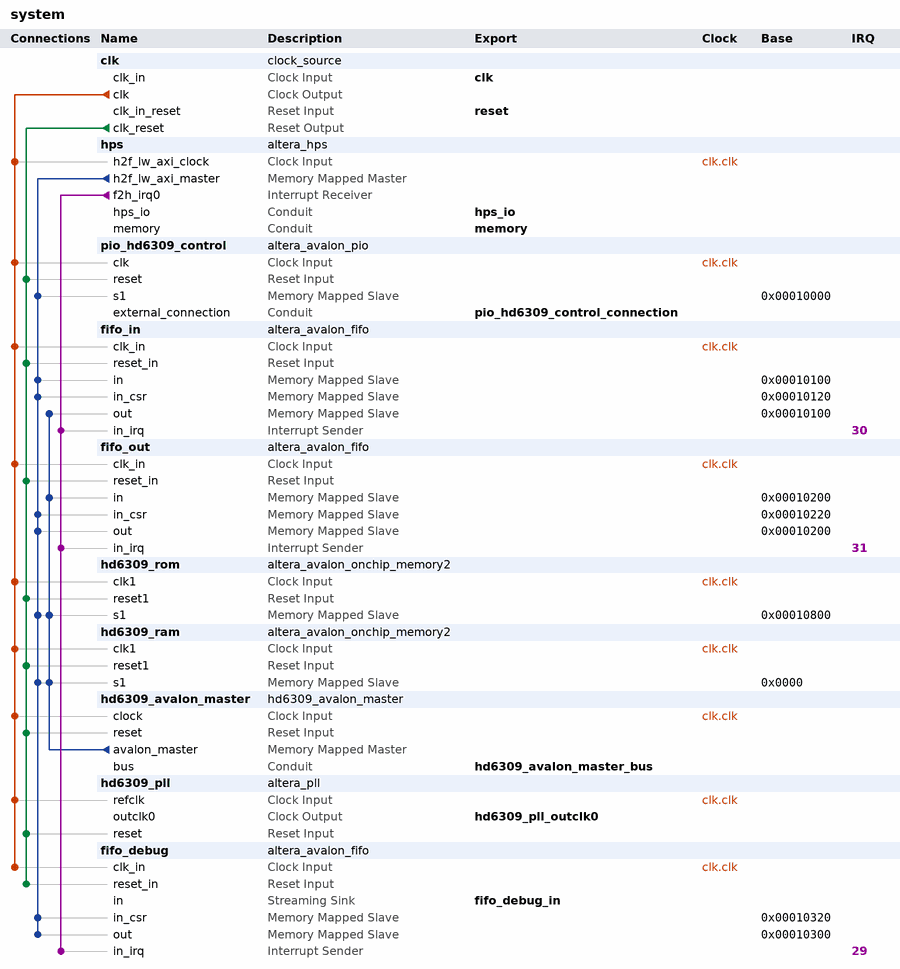
[diagram p0: system contents]
# Platform Designer (Qsys) system system, Cyclone V 5CSEMA4U23C6
# Parameters at their usual value, and those the tool derives, are not listed.
package require -exact qsys 16.1
create_system system
set_project_property DEVICE_FAMILY {Cyclone V}
set_project_property DEVICE 5CSEMA4U23C6

add_instance clk clock_source 16.1
set_instance_parameter_value clk clockFrequency 50000000

add_instance hps altera_hps 16.1
set_instance_parameter_value hps EMAC1_Mode RGMII
set_instance_parameter_value hps EMAC1_PinMuxing {HPS I/O Set 0}
set_instance_parameter_value hps F2SCLK_COLDRST_Enable false
set_instance_parameter_value hps F2SCLK_DBGRST_Enable false
set_instance_parameter_value hps F2SCLK_WARMRST_Enable false
set_instance_parameter_value hps F2SINTERRUPT_Enable true
set_instance_parameter_value hps F2S_Width 0
set_instance_parameter_value hps FPGA_PERIPHERAL_OUTPUT_CLOCK_FREQ_EMAC0_GTX_CLK 100
set_instance_parameter_value hps FPGA_PERIPHERAL_OUTPUT_CLOCK_FREQ_EMAC0_MD_CLK 100.0
set_instance_parameter_value hps FPGA_PERIPHERAL_OUTPUT_CLOCK_FREQ_EMAC1_GTX_CLK 100
set_instance_parameter_value hps FPGA_PERIPHERAL_OUTPUT_CLOCK_FREQ_EMAC1_MD_CLK 100.0
set_instance_parameter_value hps HPS_PROTOCOL DDR3
set_instance_parameter_value hps I2C0_Mode I2C
set_instance_parameter_value hps I2C0_PinMuxing {HPS I/O Set 0}
set_instance_parameter_value hps I2C1_Mode I2C
set_instance_parameter_value hps I2C1_PinMuxing {HPS I/O Set 0}
set_instance_parameter_value hps LWH2F_Enable true
set_instance_parameter_value hps MEM_BANKADDR_WIDTH 3
set_instance_parameter_value hps MEM_CLK_FREQ 400.0
set_instance_parameter_value hps MEM_COL_ADDR_WIDTH 10
set_instance_parameter_value hps MEM_DQ_WIDTH 32
set_instance_parameter_value hps MEM_DRV_STR RZQ/6
set_instance_parameter_value hps MEM_ROW_ADDR_WIDTH 15
set_instance_parameter_value hps MEM_RTT_NOM RZQ/6
set_instance_parameter_value hps MEM_RTT_WR {Dynamic ODT off}
set_instance_parameter_value hps MEM_TCL 7
set_instance_parameter_value hps MEM_TFAW_NS 37.5
set_instance_parameter_value hps MEM_TRAS_NS 35.0
set_instance_parameter_value hps MEM_TRCD_NS 13.75
set_instance_parameter_value hps MEM_TRFC_NS 300.0
set_instance_parameter_value hps MEM_TRP_NS 13.75
set_instance_parameter_value hps MEM_VENDOR Other
set_instance_parameter_value hps MEM_WTCL 7
set_instance_parameter_value hps QSPI_Mode N/A
set_instance_parameter_value hps QSPI_PinMuxing Unused
set_instance_parameter_value hps REF_CLK_FREQ 25.0
set_instance_parameter_value hps S2FCLK_USER2CLK 5
set_instance_parameter_value hps S2F_Width 0
set_instance_parameter_value hps SDIO_Mode {4-bit Data}
set_instance_parameter_value hps SDIO_PinMuxing {HPS I/O Set 0}
set_instance_parameter_value hps SPIM1_Mode {Single Slave Select}
set_instance_parameter_value hps SPIM1_PinMuxing {HPS I/O Set 0}
set_instance_parameter_value hps STM_Enable false
set_instance_parameter_value hps TIMING_BOARD_AC_SKEW 0.02
set_instance_parameter_value hps TIMING_BOARD_AC_TO_CK_SKEW 0.0
set_instance_parameter_value hps TIMING_BOARD_DQ_TO_DQS_SKEW 0.0
set_instance_parameter_value hps TIMING_BOARD_MAX_CK_DELAY 0.6
set_instance_parameter_value hps TIMING_BOARD_MAX_DQS_DELAY 0.6
set_instance_parameter_value hps TIMING_BOARD_SKEW_BETWEEN_DQS 0.02
set_instance_parameter_value hps TIMING_BOARD_SKEW_CKDQS_DIMM_MAX 0.01
set_instance_parameter_value hps TIMING_BOARD_SKEW_CKDQS_DIMM_MIN -0.01
set_instance_parameter_value hps TIMING_BOARD_SKEW_WITHIN_DQS 0.02
set_instance_parameter_value hps TIMING_TDH 125
set_instance_parameter_value hps TIMING_TDQSCK 400
set_instance_parameter_value hps TIMING_TDQSQ 120
set_instance_parameter_value hps TIMING_TDS 50
set_instance_parameter_value hps TIMING_TIH 250
set_instance_parameter_value hps TIMING_TIS 175
set_instance_parameter_value hps TIMING_TQSH 0.38
set_instance_parameter_value hps UART0_Mode {No Flow Control}
set_instance_parameter_value hps UART0_PinMuxing {HPS I/O Set 0}
set_instance_parameter_value hps USB1_Mode SDR
set_instance_parameter_value hps USB1_PinMuxing {HPS I/O Set 0}
set_instance_parameter_value hps desired_cfg_clk_mhz 100.0
set_instance_parameter_value hps desired_qspi_clk_mhz 370.0

add_instance pio_hd6309_control altera_avalon_pio 16.1
set_instance_parameter_value pio_hd6309_control bitModifyingOutReg true
set_instance_parameter_value pio_hd6309_control direction Output
set_instance_parameter_value pio_hd6309_control width 8

add_instance fifo_in altera_avalon_fifo 16.1
set_instance_parameter_value fifo_in avalonMMAvalonMMDataWidth 8
set_instance_parameter_value fifo_in bitsPerSymbol 16
set_instance_parameter_value fifo_in channelWidth 8
set_instance_parameter_value fifo_in errorWidth 8
set_instance_parameter_value fifo_in fifoDepth 16
set_instance_parameter_value fifo_in fifoInputInterfaceOptions AVALONMM_WRITE
set_instance_parameter_value fifo_in fifoOutputInterfaceOptions AVALONMM_READ
set_instance_parameter_value fifo_in singleClockMode true
set_instance_parameter_value fifo_in symbolsPerBeat 2
set_instance_parameter_value fifo_in useIRQ true
set_instance_parameter_value fifo_in usePacket true
set_instance_parameter_value fifo_in useReadControl false

add_instance fifo_out altera_avalon_fifo 16.1
set_instance_parameter_value fifo_out avalonMMAvalonMMDataWidth 8
set_instance_parameter_value fifo_out bitsPerSymbol 16
set_instance_parameter_value fifo_out channelWidth 8
set_instance_parameter_value fifo_out errorWidth 8
set_instance_parameter_value fifo_out fifoDepth 16
set_instance_parameter_value fifo_out fifoInputInterfaceOptions AVALONMM_WRITE
set_instance_parameter_value fifo_out fifoOutputInterfaceOptions AVALONMM_READ
set_instance_parameter_value fifo_out singleClockMode true
set_instance_parameter_value fifo_out symbolsPerBeat 2
set_instance_parameter_value fifo_out useIRQ true
set_instance_parameter_value fifo_out usePacket true
set_instance_parameter_value fifo_out useReadControl false

add_instance hd6309_rom altera_avalon_onchip_memory2 16.1
set_instance_parameter_value hd6309_rom dataWidth 8
set_instance_parameter_value hd6309_rom dualPort false
set_instance_parameter_value hd6309_rom initMemContent true
set_instance_parameter_value hd6309_rom initializationFileName rom6809.hex
set_instance_parameter_value hd6309_rom memorySize 2048
set_instance_parameter_value hd6309_rom useNonDefaultInitFile true
set_instance_parameter_value hd6309_rom writable false

add_instance hd6309_ram altera_avalon_onchip_memory2 16.1
set_instance_parameter_value hd6309_ram dataWidth 8
set_instance_parameter_value hd6309_ram dualPort false
set_instance_parameter_value hd6309_ram initMemContent true
set_instance_parameter_value hd6309_ram initializationFileName onchip_mem.hex
set_instance_parameter_value hd6309_ram memorySize 65536

add_instance hd6309_avalon_master hd6309_avalon_master 0.1.1
set_instance_parameter_value hd6309_avalon_master WIDTH 20

add_instance hd6309_pll altera_pll 16.1
set_instance_parameter_value hd6309_pll gui_device_speed_grade 1
set_instance_parameter_value hd6309_pll gui_number_of_clocks 1
set_instance_parameter_value hd6309_pll gui_operation_mode direct
set_instance_parameter_value hd6309_pll gui_output_clock_frequency0 12.0
set_instance_parameter_value hd6309_pll gui_pll_mode {Integer-N PLL}
set_instance_parameter_value hd6309_pll gui_reference_clock_frequency 50.0
set_instance_parameter_value hd6309_pll gui_use_locked false

add_instance fifo_debug altera_avalon_fifo 16.1
set_instance_parameter_value fifo_debug bitsPerSymbol 32
set_instance_parameter_value fifo_debug channelWidth 0
set_instance_parameter_value fifo_debug errorWidth 0
set_instance_parameter_value fifo_debug fifoDepth 32
set_instance_parameter_value fifo_debug fifoInputInterfaceOptions AVALONST_SINK
set_instance_parameter_value fifo_debug fifoOutputInterfaceOptions AVALONMM_READ
set_instance_parameter_value fifo_debug singleClockMode true
set_instance_parameter_value fifo_debug symbolsPerBeat 1
set_instance_parameter_value fifo_debug useBackpressure false
set_instance_parameter_value fifo_debug useIRQ true
set_instance_parameter_value fifo_debug usePacket false
set_instance_parameter_value fifo_debug useReadControl false

# connections
add_connection clk.clk fifo_debug.clk_in clock
add_connection clk.clk fifo_in.clk_in clock
add_connection clk.clk fifo_out.clk_in clock
add_connection clk.clk hd6309_avalon_master.clock clock
add_connection clk.clk hd6309_pll.refclk clock
add_connection clk.clk hd6309_ram.clk1 clock
add_connection clk.clk hd6309_rom.clk1 clock
add_connection clk.clk hps.h2f_lw_axi_clock clock
add_connection clk.clk pio_hd6309_control.clk clock
add_connection clk.clk_reset fifo_debug.reset_in reset
add_connection clk.clk_reset fifo_in.reset_in reset
add_connection clk.clk_reset fifo_out.reset_in reset
add_connection clk.clk_reset hd6309_avalon_master.reset reset
add_connection clk.clk_reset hd6309_pll.reset reset
add_connection clk.clk_reset hd6309_ram.reset1 reset
add_connection clk.clk_reset hd6309_rom.reset1 reset
add_connection clk.clk_reset pio_hd6309_control.reset reset
add_connection hd6309_avalon_master.avalon_master fifo_in.out avalon
set_connection_parameter_value hd6309_avalon_master.avalon_master/fifo_in.out baseAddress 0x00010100
add_connection hd6309_avalon_master.avalon_master fifo_out.in avalon
set_connection_parameter_value hd6309_avalon_master.avalon_master/fifo_out.in baseAddress 0x00010200
add_connection hd6309_avalon_master.avalon_master hd6309_ram.s1 avalon
set_connection_parameter_value hd6309_avalon_master.avalon_master/hd6309_ram.s1 baseAddress 0x0000
add_connection hd6309_avalon_master.avalon_master hd6309_rom.s1 avalon
set_connection_parameter_value hd6309_avalon_master.avalon_master/hd6309_rom.s1 baseAddress 0x00010800
add_connection hps.h2f_lw_axi_master fifo_debug.in_csr avalon
set_connection_parameter_value hps.h2f_lw_axi_master/fifo_debug.in_csr baseAddress 0x00010320
add_connection hps.h2f_lw_axi_master fifo_debug.out avalon
set_connection_parameter_value hps.h2f_lw_axi_master/fifo_debug.out baseAddress 0x00010300
add_connection hps.h2f_lw_axi_master fifo_in.in avalon
set_connection_parameter_value hps.h2f_lw_axi_master/fifo_in.in baseAddress 0x00010100
add_connection hps.h2f_lw_axi_master fifo_in.in_csr avalon
set_connection_parameter_value hps.h2f_lw_axi_master/fifo_in.in_csr baseAddress 0x00010120
add_connection hps.h2f_lw_axi_master fifo_out.in_csr avalon
set_connection_parameter_value hps.h2f_lw_axi_master/fifo_out.in_csr baseAddress 0x00010220
add_connection hps.h2f_lw_axi_master fifo_out.out avalon
set_connection_parameter_value hps.h2f_lw_axi_master/fifo_out.out baseAddress 0x00010200
add_connection hps.h2f_lw_axi_master hd6309_ram.s1 avalon
set_connection_parameter_value hps.h2f_lw_axi_master/hd6309_ram.s1 baseAddress 0x0000
add_connection hps.h2f_lw_axi_master hd6309_rom.s1 avalon
set_connection_parameter_value hps.h2f_lw_axi_master/hd6309_rom.s1 baseAddress 0x00010800
add_connection hps.h2f_lw_axi_master pio_hd6309_control.s1 avalon
set_connection_parameter_value hps.h2f_lw_axi_master/pio_hd6309_control.s1 baseAddress 0x00010000
add_connection hps.f2h_irq0 fifo_debug.in_irq interrupt
set_connection_parameter_value hps.f2h_irq0/fifo_debug.in_irq irqNumber 29
add_connection hps.f2h_irq0 fifo_in.in_irq interrupt
set_connection_parameter_value hps.f2h_irq0/fifo_in.in_irq irqNumber 30
add_connection hps.f2h_irq0 fifo_out.in_irq interrupt
set_connection_parameter_value hps.f2h_irq0/fifo_out.in_irq irqNumber 31

# exported interfaces
add_interface clk clock sink
set_interface_property clk EXPORT_OF clk.clk_in
add_interface fifo_debug_in avalon_streaming sink
set_interface_property fifo_debug_in EXPORT_OF fifo_debug.in
add_interface hd6309_avalon_master_bus conduit end
set_interface_property hd6309_avalon_master_bus EXPORT_OF hd6309_avalon_master.bus
add_interface hd6309_pll_outclk0 clock source
set_interface_property hd6309_pll_outclk0 EXPORT_OF hd6309_pll.outclk0
add_interface hps_io conduit end
set_interface_property hps_io EXPORT_OF hps.hps_io
add_interface memory conduit end
set_interface_property memory EXPORT_OF hps.memory
add_interface pio_hd6309_control_connection conduit end
set_interface_property pio_hd6309_control_connection EXPORT_OF pio_hd6309_control.external_connection
add_interface reset reset sink
set_interface_property reset EXPORT_OF clk.clk_in_reset

set_interconnect_requirement {$system} qsys_mm.clockCrossingAdapter HANDSHAKE
set_interconnect_requirement {$system} qsys_mm.enableEccProtection FALSE
set_interconnect_requirement {$system} qsys_mm.insertDefaultSlave FALSE
set_interconnect_requirement {$system} qsys_mm.maxAdditionalLatency 1

save_system system.qsys
